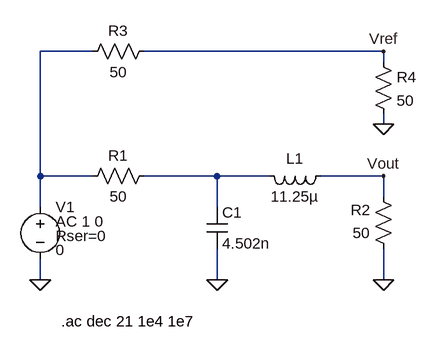
[diagram p0: schematic N=1Slide21.asc]
N=1Slide21.asc, the LTspice schematic file:
Version 4
SHEET 1 880 680
WIRE 192 112 112 112
WIRE 640 112 272 112
WIRE 640 128 640 112
WIRE 640 224 640 208
WIRE 112 304 112 112
WIRE 192 304 112 304
WIRE 384 304 272 304
WIRE 464 304 384 304
WIRE 640 304 544 304
WIRE 640 336 640 304
WIRE 112 352 112 304
WIRE 384 352 384 304
WIRE 112 464 112 432
WIRE 384 464 384 416
WIRE 640 464 640 416
FLAG 112 464 0
FLAG 640 464 0
FLAG 384 464 0
FLAG 640 224 0
FLAG 640 112 Vref
FLAG 640 304 Vout
SYMBOL Res 288 288 R90
WINDOW 0 0 56 VBottom 2
WINDOW 3 32 56 VTop 2
SYMATTR InstName R1
SYMATTR Value 50
SYMBOL Res 656 432 R180
WINDOW 0 36 76 Left 2
WINDOW 3 36 40 Left 2
SYMATTR InstName R2
SYMATTR Value 50
SYMBOL Res 176 128 R270
WINDOW 0 32 56 VTop 2
WINDOW 3 0 56 VBottom 2
SYMATTR InstName R3
SYMATTR Value 50
SYMBOL Voltage 112 336 R0
WINDOW 3 24 82 Left 2
WINDOW 123 24 38 Left 2
WINDOW 39 24 60 Left 2
SYMATTR InstName V1
SYMATTR Value 0
SYMATTR Value2 AC 1 0
SYMATTR SpiceLine Rser=0
SYMBOL Res 624 112 R0
SYMATTR InstName R4
SYMATTR Value 50
SYMBOL Cap 368 352 R0
SYMATTR InstName C1
SYMATTR Value 4.502n
SYMBOL Ind 560 288 R90
WINDOW 0 5 56 VBottom 2
WINDOW 3 32 56 VTop 2
SYMATTR InstName L1
SYMATTR Value 11.25µ
TEXT 144 528 Left 2 !.ac dec 21 1e4 1e7

The netlist it stands for:
* N=1Slide21.asc
R1 N002 N001 50
R2 0 Vout 50
R3 N001 Vref 50
V1 N001 0 0 AC 1 0 Rser=0
R4 Vref 0 50
C1 N002 0 4.502n
L1 Vout N002 11.25µ
.ac dec 21 1e4 1e7
.backanno
.end